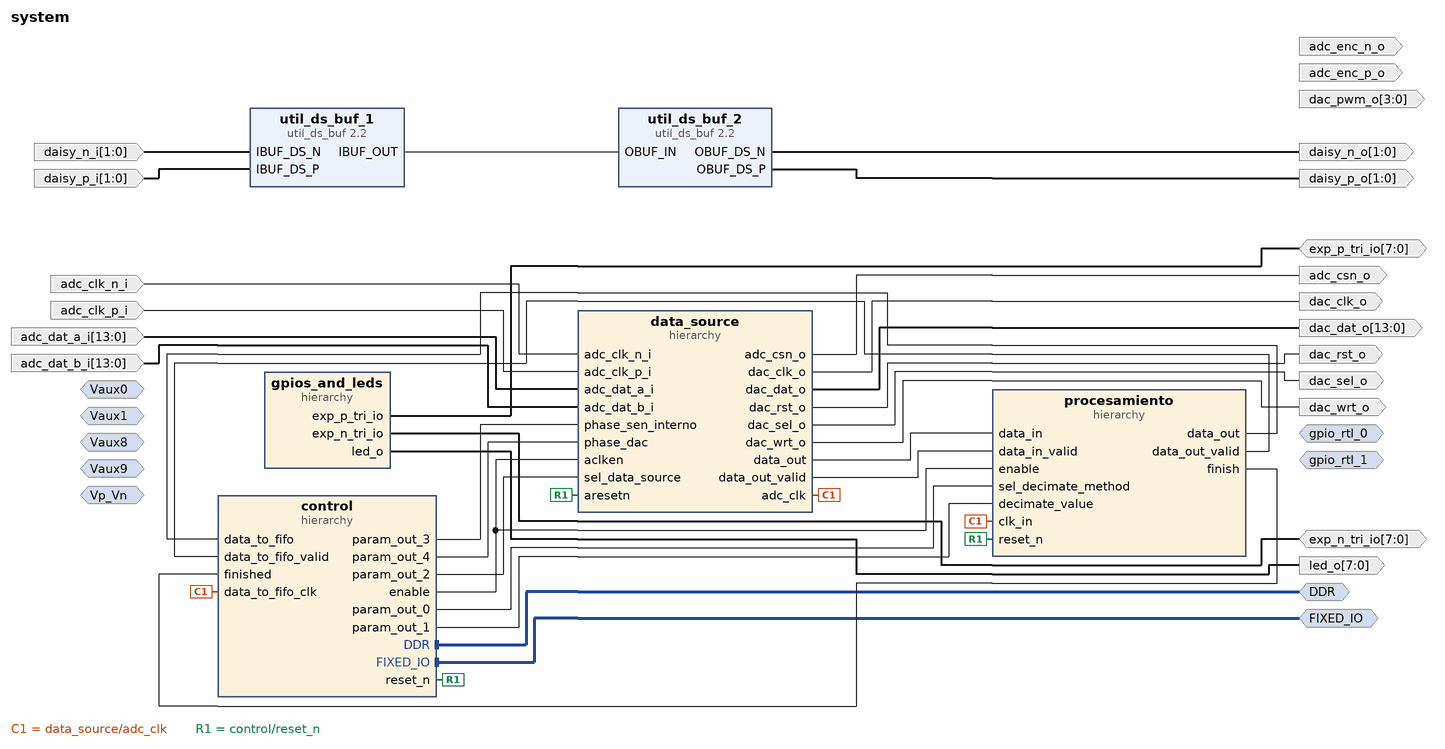
[diagram p0: block diagram of the top level]
# Vivado block design system, xc7z010clg400-1, Vivado 2022.2
create_bd_design system

create_bd_intf_port -mode Slave -vlnv xilinx.com:interface:diff_analog_io_rtl:1.0 Vp_Vn
create_bd_intf_port -mode Slave -vlnv xilinx.com:interface:diff_analog_io_rtl:1.0 Vaux0
create_bd_intf_port -mode Slave -vlnv xilinx.com:interface:diff_analog_io_rtl:1.0 Vaux1
create_bd_intf_port -mode Slave -vlnv xilinx.com:interface:diff_analog_io_rtl:1.0 Vaux9
create_bd_intf_port -mode Slave -vlnv xilinx.com:interface:diff_analog_io_rtl:1.0 Vaux8
create_bd_intf_port -mode Master -vlnv xilinx.com:interface:ddrx_rtl:1.0 DDR
create_bd_intf_port -mode Master -vlnv xilinx.com:display_processing_system7:fixedio_rtl:1.0 FIXED_IO
create_bd_intf_port -mode Master -vlnv xilinx.com:interface:gpio_rtl:1.0 gpio_rtl_0
create_bd_intf_port -mode Master -vlnv xilinx.com:interface:gpio_rtl:1.0 gpio_rtl_1
create_bd_port -dir I -from 13 -to 0 adc_dat_a_i
create_bd_port -dir I -from 13 -to 0 adc_dat_b_i
create_bd_port -dir I adc_clk_p_i
create_bd_port -dir I adc_clk_n_i
create_bd_port -dir O adc_enc_p_o
create_bd_port -dir O adc_enc_n_o
create_bd_port -dir O adc_csn_o
create_bd_port -dir O -from 13 -to 0 dac_dat_o
create_bd_port -dir O dac_clk_o
create_bd_port -dir O dac_rst_o
create_bd_port -dir O dac_sel_o
create_bd_port -dir O dac_wrt_o
create_bd_port -dir O -from 3 -to 0 dac_pwm_o
create_bd_port -dir IO -from 7 -to 0 exp_p_tri_io
create_bd_port -dir IO -from 7 -to 0 exp_n_tri_io
create_bd_port -dir O -from 1 -to 0 daisy_p_o
create_bd_port -dir O -from 1 -to 0 daisy_n_o
create_bd_port -dir I -from 1 -to 0 daisy_p_i
create_bd_port -dir I -from 1 -to 0 daisy_n_i
create_bd_port -dir O -from 7 -to 0 led_o

create_bd_cell -type ip -vlnv xilinx.com:ip:util_ds_buf:2.2 util_ds_buf_1
set_property -dict {CONFIG.C_SIZE 2} [get_bd_cells util_ds_buf_1]
create_bd_cell -type ip -vlnv xilinx.com:ip:util_ds_buf:2.2 util_ds_buf_2
set_property -dict {CONFIG.C_BUF_TYPE OBUFDS CONFIG.C_SIZE 2} [get_bd_cells util_ds_buf_2]
create_bd_cell -type hier gpios_and_leds
create_bd_cell -type hier control
create_bd_cell -type hier procesamiento
create_bd_cell -type hier data_source

# ---- hierarchy /gpios_and_leds ----
current_bd_instance /gpios_and_leds
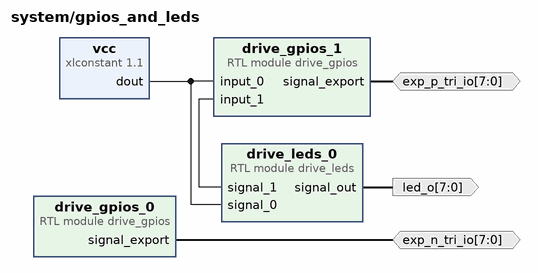
[diagram p1: block diagram inside /gpios_and_leds]
create_bd_pin -dir IO -from 7 -to 0 exp_n_tri_io
create_bd_pin -dir IO -from 7 -to 0 exp_p_tri_io
create_bd_pin -dir O -from 7 -to 0 led_o

create_bd_cell -type module -reference drive_gpios drive_gpios_0
create_bd_cell -type module -reference drive_gpios drive_gpios_1
create_bd_cell -type module -reference drive_leds drive_leds_0
create_bd_cell -type ip -vlnv xilinx.com:ip:xlconstant:1.1 vcc

# ---- hierarchy /control ----
current_bd_instance /control
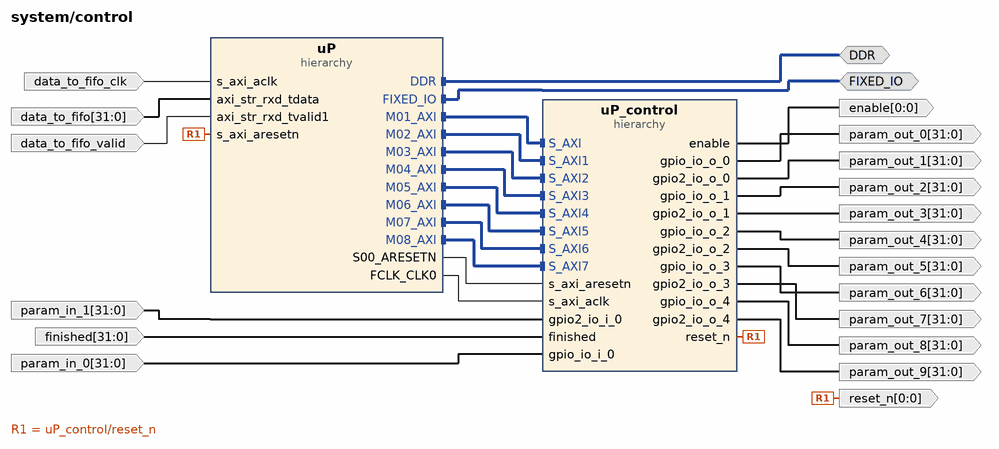
[diagram p2: block diagram inside /control]
create_bd_intf_pin -mode Master -vlnv xilinx.com:interface:ddrx_rtl:1.0 DDR
create_bd_intf_pin -mode Master -vlnv xilinx.com:display_processing_system7:fixedio_rtl:1.0 FIXED_IO
create_bd_pin -dir I data_to_fifo_valid
create_bd_pin -dir O -from 0 -to 0 reset_n
create_bd_pin -dir I -from 31 -to 0 data_to_fifo
create_bd_pin -dir I -type clk data_to_fifo_clk
create_bd_pin -dir O -from 0 -to 0 enable
create_bd_pin -dir O -from 31 -to 0 param_out_1
create_bd_pin -dir O -from 31 -to 0 param_out_0
create_bd_pin -dir O -from 31 -to 0 param_out_2
create_bd_pin -dir O -from 31 -to 0 param_out_3
create_bd_pin -dir O -from 31 -to 0 param_out_4
create_bd_pin -dir O -from 31 -to 0 param_out_5
create_bd_pin -dir O -from 31 -to 0 param_out_6
create_bd_pin -dir O -from 31 -to 0 param_out_7
create_bd_pin -dir O -from 31 -to 0 param_out_8
create_bd_pin -dir O -from 31 -to 0 param_out_9
create_bd_pin -dir I -from 31 -to 0 finished
create_bd_pin -dir I -from 31 -to 0 param_in_0
create_bd_pin -dir I -from 31 -to 0 param_in_1

create_bd_cell -type hier uP
create_bd_cell -type hier uP_control

# ---- hierarchy /control/uP ----
current_bd_instance /control/uP
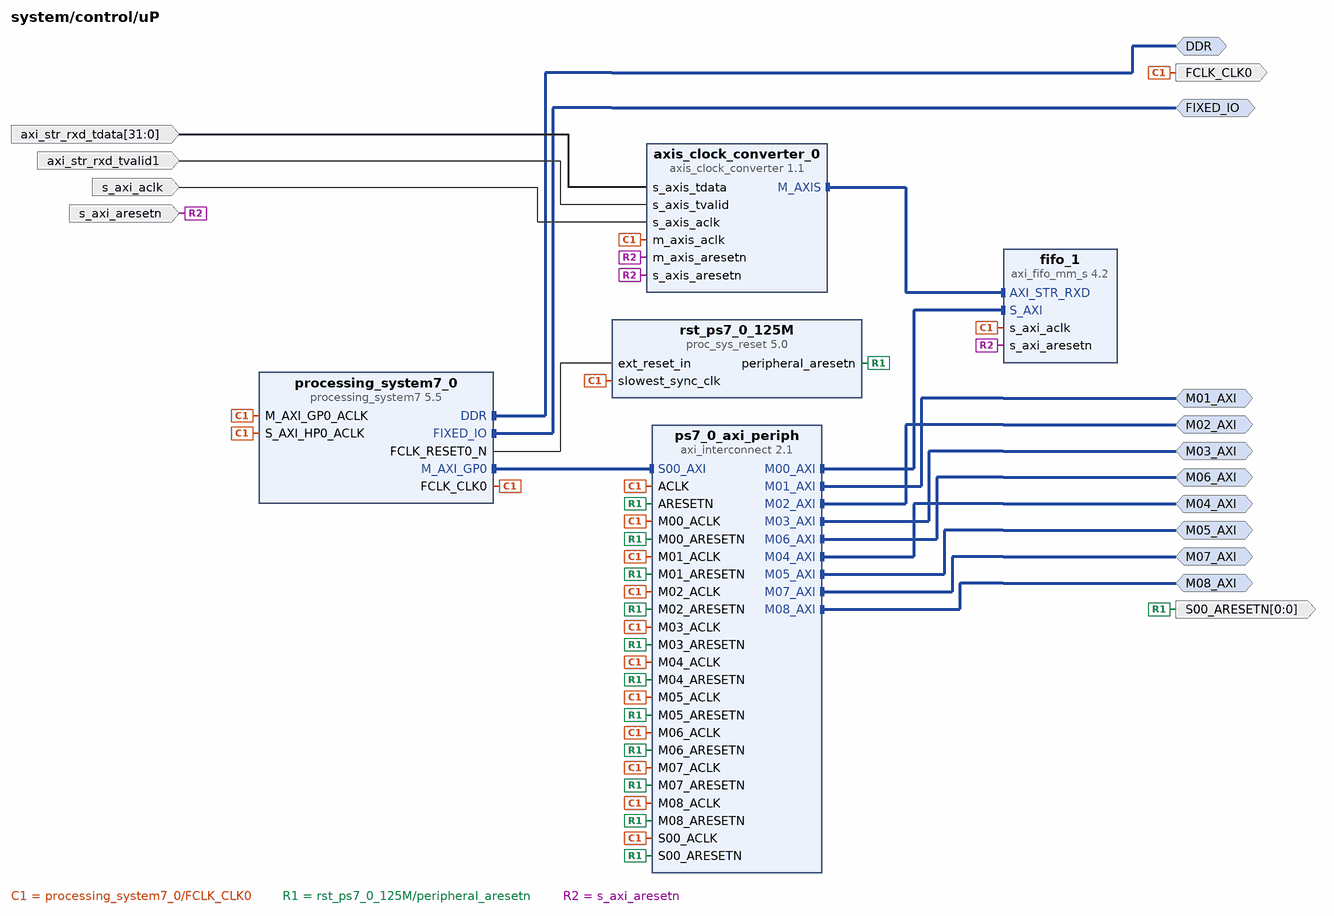
[diagram p3: block diagram inside /control/uP]
create_bd_intf_pin -mode Master -vlnv xilinx.com:interface:ddrx_rtl:1.0 DDR
create_bd_intf_pin -mode Master -vlnv xilinx.com:display_processing_system7:fixedio_rtl:1.0 FIXED_IO
create_bd_intf_pin -mode Master -vlnv xilinx.com:interface:aximm_rtl:1.0 M01_AXI
create_bd_intf_pin -mode Master -vlnv xilinx.com:interface:aximm_rtl:1.0 M03_AXI
create_bd_intf_pin -mode Master -vlnv xilinx.com:interface:aximm_rtl:1.0 M05_AXI
create_bd_intf_pin -mode Master -vlnv xilinx.com:interface:aximm_rtl:1.0 M06_AXI
create_bd_intf_pin -mode Master -vlnv xilinx.com:interface:aximm_rtl:1.0 M02_AXI
create_bd_intf_pin -mode Master -vlnv xilinx.com:interface:aximm_rtl:1.0 M07_AXI
create_bd_intf_pin -mode Master -vlnv xilinx.com:interface:aximm_rtl:1.0 M08_AXI
create_bd_intf_pin -mode Master -vlnv xilinx.com:interface:aximm_rtl:1.0 M04_AXI
create_bd_pin -dir O -type clk FCLK_CLK0
create_bd_pin -dir O -from 0 -to 0 -type rst S00_ARESETN
create_bd_pin -dir I axi_str_rxd_tvalid1
create_bd_pin -dir I -type rst s_axi_aresetn
create_bd_pin -dir I -from 31 -to 0 axi_str_rxd_tdata
create_bd_pin -dir I -type clk s_axi_aclk

create_bd_cell -type ip -vlnv xilinx.com:ip:processing_system7:5.5 processing_system7_0
set_property -dict [list \
  CONFIG.PCW_APU_PERIPHERAL_FREQMHZ 666.666666 \
  CONFIG.PCW_ENET0_ENET0_IO {MIO 16 .. 27} \
  CONFIG.PCW_ENET0_GRP_MDIO_ENABLE 1 \
  CONFIG.PCW_ENET0_GRP_MDIO_IO EMIO \
  CONFIG.PCW_ENET0_PERIPHERAL_ENABLE 1 \
  CONFIG.PCW_ENET0_RESET_ENABLE 0 \
  CONFIG.PCW_ENET_RESET_ENABLE 1 \
  CONFIG.PCW_ENET_RESET_SELECT {Share reset pin} \
  CONFIG.PCW_FPGA0_PERIPHERAL_FREQMHZ 125 \
  CONFIG.PCW_FPGA1_PERIPHERAL_FREQMHZ 250 \
  CONFIG.PCW_FPGA3_PERIPHERAL_FREQMHZ 200 \
  CONFIG.PCW_GPIO_MIO_GPIO_ENABLE 1 \
  CONFIG.PCW_GPIO_MIO_GPIO_IO MIO \
  CONFIG.PCW_GPIO_PERIPHERAL_ENABLE 1 \
  CONFIG.PCW_I2C0_GRP_INT_ENABLE 0 \
  CONFIG.PCW_I2C0_I2C0_IO {MIO 50 .. 51} \
  CONFIG.PCW_I2C0_PERIPHERAL_ENABLE 1 \
  CONFIG.PCW_I2C_PERIPHERAL_FREQMHZ 111.111115 \
  CONFIG.PCW_I2C_RESET_ENABLE 1 \
  CONFIG.PCW_I2C_RESET_SELECT {Share reset pin} \
  CONFIG.PCW_IMPORT_BOARD_PRESET cfg/red_pitaya.xml \
  CONFIG.PCW_PRESET_BANK1_VOLTAGE {LVCMOS 2.5V} \
  CONFIG.PCW_QSPI_GRP_SINGLE_SS_ENABLE 1 \
  CONFIG.PCW_QSPI_GRP_SINGLE_SS_IO {MIO 1 .. 6} \
  CONFIG.PCW_QSPI_PERIPHERAL_ENABLE 1 \
  CONFIG.PCW_QSPI_PERIPHERAL_FREQMHZ 125 \
  CONFIG.PCW_QSPI_QSPI_IO {MIO 1 .. 6} \
  CONFIG.PCW_SD0_GRP_CD_ENABLE 1 \
  CONFIG.PCW_SD0_GRP_CD_IO {MIO 46} \
  CONFIG.PCW_SD0_GRP_WP_ENABLE 1 \
  CONFIG.PCW_SD0_GRP_WP_IO {MIO 47} \
  CONFIG.PCW_SD0_PERIPHERAL_ENABLE 1 \
  CONFIG.PCW_SD0_SD0_IO {MIO 40 .. 45} \
  CONFIG.PCW_SDIO_PERIPHERAL_FREQMHZ 100 \
  CONFIG.PCW_SINGLE_QSPI_DATA_MODE x4 \
  CONFIG.PCW_SPI0_PERIPHERAL_ENABLE 1 \
  CONFIG.PCW_SPI0_SPI0_IO EMIO \
  CONFIG.PCW_SPI1_PERIPHERAL_ENABLE 1 \
  CONFIG.PCW_SPI1_SPI1_IO {MIO 10 .. 15} \
  CONFIG.PCW_TTC0_PERIPHERAL_ENABLE 1 \
  CONFIG.PCW_TTC0_TTC0_IO EMIO \
  CONFIG.PCW_UART0_PERIPHERAL_ENABLE 1 \
  CONFIG.PCW_UART0_UART0_IO {MIO 14 .. 15} \
  CONFIG.PCW_UART1_PERIPHERAL_ENABLE 1 \
  CONFIG.PCW_UART1_UART1_IO {MIO 8 .. 9} \
  CONFIG.PCW_UART_PERIPHERAL_FREQMHZ 100 \
  CONFIG.PCW_UIPARAM_DDR_BUS_WIDTH {16 Bit} \
  CONFIG.PCW_UIPARAM_DDR_FREQ_MHZ 533.333333 \
  CONFIG.PCW_UIPARAM_DDR_PARTNO {MT41J256M16 RE-125} \
  CONFIG.PCW_USB0_PERIPHERAL_ENABLE 1 \
  CONFIG.PCW_USB0_RESET_ENABLE 1 \
  CONFIG.PCW_USB0_RESET_IO {MIO 48} \
  CONFIG.PCW_USB0_USB0_IO {MIO 28 .. 39} \
  CONFIG.PCW_USB_RESET_ENABLE 1 \
  CONFIG.PCW_USB_RESET_SELECT {Share reset pin} \
  CONFIG.PCW_USE_S_AXI_HP0 1 \
] [get_bd_cells processing_system7_0]
# 429 more settings of processing_system7_0 are not shown: defaults, MIO pin electricals, DDR timing, and values the tool derives
create_bd_cell -type ip -vlnv xilinx.com:ip:proc_sys_reset:5.0 rst_ps7_0_125M
create_bd_cell -type ip -vlnv xilinx.com:ip:axi_interconnect:2.1 ps7_0_axi_periph
set_property -dict {CONFIG.NUM_MI 9} [get_bd_cells ps7_0_axi_periph]
create_bd_cell -type ip -vlnv xilinx.com:ip:axi_fifo_mm_s:4.2 fifo_1
set_property -dict {CONFIG.C_DATA_INTERFACE_TYPE 0 CONFIG.C_USE_TX_CTRL 0 CONFIG.C_USE_TX_DATA 0} [get_bd_cells fifo_1]
create_bd_cell -type ip -vlnv xilinx.com:ip:axis_clock_converter:1.1 axis_clock_converter_0
set_property -dict [list \
  CONFIG.ACLKEN_CONV_MODE 0 \
  CONFIG.IS_ACLK_ASYNC 1 \
  CONFIG.SYNCHRONIZATION_STAGES 2 \
  CONFIG.TDATA_NUM_BYTES 4 \
] [get_bd_cells axis_clock_converter_0]

# ---- hierarchy /control/uP_control ----
current_bd_instance /control/uP_control
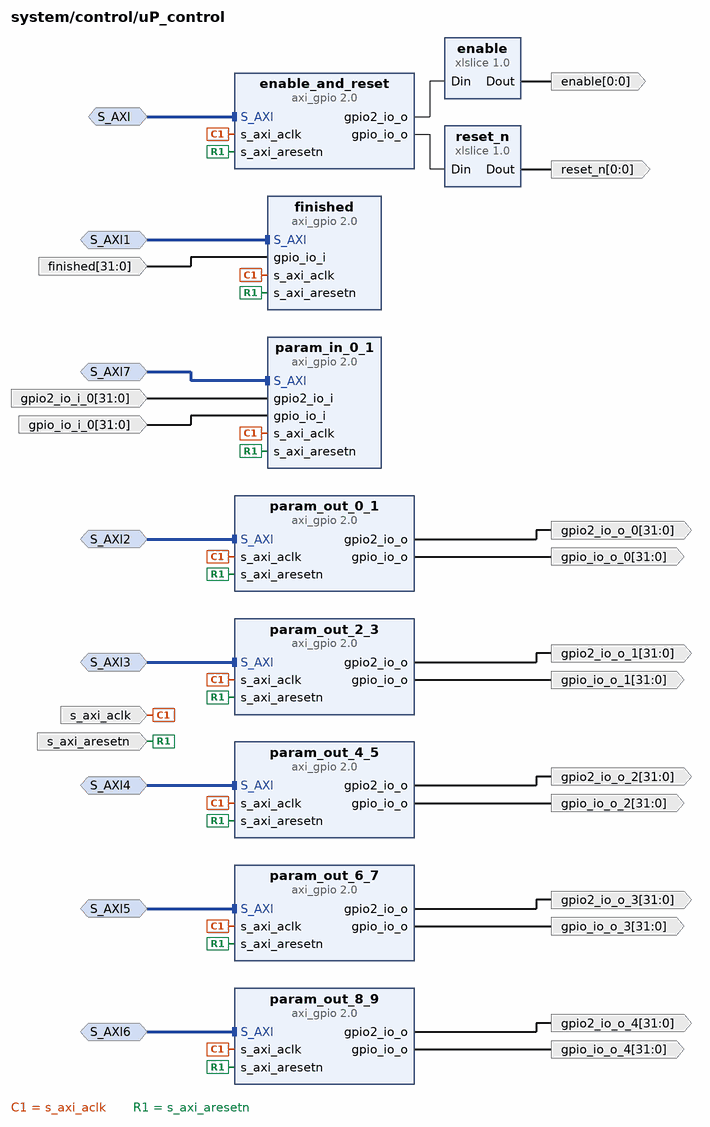
[diagram p4: block diagram inside /control/uP_control]
create_bd_intf_pin -mode Slave -vlnv xilinx.com:interface:aximm_rtl:1.0 S_AXI
create_bd_intf_pin -mode Slave -vlnv xilinx.com:interface:aximm_rtl:1.0 S_AXI1
create_bd_intf_pin -mode Slave -vlnv xilinx.com:interface:aximm_rtl:1.0 S_AXI2
create_bd_intf_pin -mode Slave -vlnv xilinx.com:interface:aximm_rtl:1.0 S_AXI3
create_bd_intf_pin -mode Slave -vlnv xilinx.com:interface:aximm_rtl:1.0 S_AXI4
create_bd_intf_pin -mode Slave -vlnv xilinx.com:interface:aximm_rtl:1.0 S_AXI5
create_bd_intf_pin -mode Slave -vlnv xilinx.com:interface:aximm_rtl:1.0 S_AXI6
create_bd_intf_pin -mode Slave -vlnv xilinx.com:interface:aximm_rtl:1.0 S_AXI7
create_bd_pin -dir I -type clk s_axi_aclk
create_bd_pin -dir I -type rst s_axi_aresetn
create_bd_pin -dir O -from 0 -to 0 reset_n
create_bd_pin -dir O -from 0 -to 0 enable
create_bd_pin -dir O -from 31 -to 0 gpio2_io_o_0
create_bd_pin -dir O -from 31 -to 0 gpio_io_o_0
create_bd_pin -dir O -from 31 -to 0 gpio_io_o_1
create_bd_pin -dir O -from 31 -to 0 gpio2_io_o_1
create_bd_pin -dir O -from 31 -to 0 gpio_io_o_2
create_bd_pin -dir O -from 31 -to 0 gpio2_io_o_2
create_bd_pin -dir O -from 31 -to 0 gpio_io_o_3
create_bd_pin -dir O -from 31 -to 0 gpio2_io_o_3
create_bd_pin -dir O -from 31 -to 0 gpio_io_o_4
create_bd_pin -dir O -from 31 -to 0 gpio2_io_o_4
create_bd_pin -dir I -from 31 -to 0 finished
create_bd_pin -dir I -from 31 -to 0 gpio_io_i_0
create_bd_pin -dir I -from 31 -to 0 gpio2_io_i_0

create_bd_cell -type ip -vlnv xilinx.com:ip:xlslice:1.0 reset_n
set_property -dict {CONFIG.DIN_FROM 0 CONFIG.DIN_TO 0 CONFIG.DOUT_WIDTH 1} [get_bd_cells reset_n]
create_bd_cell -type ip -vlnv xilinx.com:ip:axi_gpio:2.0 finished
set_property -dict {CONFIG.C_ALL_INPUTS 1 CONFIG.C_IS_DUAL 0} [get_bd_cells finished]
create_bd_cell -type ip -vlnv xilinx.com:ip:xlslice:1.0 enable
set_property -dict {CONFIG.DIN_FROM 0} [get_bd_cells enable]
create_bd_cell -type ip -vlnv xilinx.com:ip:axi_gpio:2.0 enable_and_reset
set_property -dict {CONFIG.C_ALL_INPUTS 0 CONFIG.C_ALL_OUTPUTS 0 CONFIG.C_IS_DUAL 1} [get_bd_cells enable_and_reset]
create_bd_cell -type ip -vlnv xilinx.com:ip:axi_gpio:2.0 param_out_4_5
set_property -dict [list \
  CONFIG.C_ALL_INPUTS 0 \
  CONFIG.C_ALL_OUTPUTS 1 \
  CONFIG.C_ALL_OUTPUTS_2 1 \
  CONFIG.C_IS_DUAL 1 \
] [get_bd_cells param_out_4_5]
create_bd_cell -type ip -vlnv xilinx.com:ip:axi_gpio:2.0 param_out_2_3
set_property -dict [list \
  CONFIG.C_ALL_INPUTS 0 \
  CONFIG.C_ALL_OUTPUTS 1 \
  CONFIG.C_ALL_OUTPUTS_2 1 \
  CONFIG.C_IS_DUAL 1 \
] [get_bd_cells param_out_2_3]
create_bd_cell -type ip -vlnv xilinx.com:ip:axi_gpio:2.0 param_out_6_7
set_property -dict [list \
  CONFIG.C_ALL_INPUTS 0 \
  CONFIG.C_ALL_OUTPUTS 1 \
  CONFIG.C_ALL_OUTPUTS_2 1 \
  CONFIG.C_IS_DUAL 1 \
] [get_bd_cells param_out_6_7]
create_bd_cell -type ip -vlnv xilinx.com:ip:axi_gpio:2.0 param_out_0_1
set_property -dict [list \
  CONFIG.C_ALL_INPUTS 0 \
  CONFIG.C_ALL_OUTPUTS 1 \
  CONFIG.C_ALL_OUTPUTS_2 1 \
  CONFIG.C_IS_DUAL 1 \
] [get_bd_cells param_out_0_1]
create_bd_cell -type ip -vlnv xilinx.com:ip:axi_gpio:2.0 param_out_8_9
set_property -dict [list \
  CONFIG.C_ALL_INPUTS 0 \
  CONFIG.C_ALL_OUTPUTS 1 \
  CONFIG.C_ALL_OUTPUTS_2 1 \
  CONFIG.C_IS_DUAL 1 \
] [get_bd_cells param_out_8_9]
create_bd_cell -type ip -vlnv xilinx.com:ip:axi_gpio:2.0 param_in_0_1
set_property -dict {CONFIG.C_ALL_INPUTS 1 CONFIG.C_ALL_INPUTS_2 1 CONFIG.C_IS_DUAL 1} [get_bd_cells param_in_0_1]

# ---- hierarchy /procesamiento ----
current_bd_instance /procesamiento
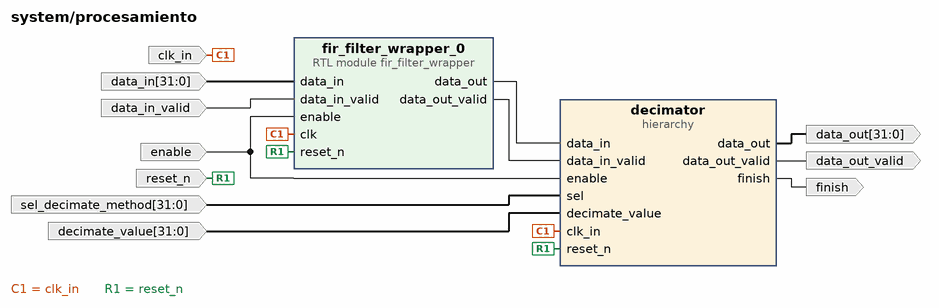
[diagram p5: block diagram inside /procesamiento]
create_bd_pin -dir I clk_in
create_bd_pin -dir I reset_n
create_bd_pin -dir I enable
create_bd_pin -dir I data_in_valid
create_bd_pin -dir I -from 31 -to 0 decimate_value
create_bd_pin -dir O -from 31 -to 0 data_out
create_bd_pin -dir O data_out_valid
create_bd_pin -dir I -from 31 -to 0 sel_decimate_method
create_bd_pin -dir I -from 31 -to 0 data_in
create_bd_pin -dir O finish

create_bd_cell -type hier decimator
create_bd_cell -type module -reference fir_filter_wrapper fir_filter_wrapper_0

# ---- hierarchy /procesamiento/decimator ----
current_bd_instance /procesamiento/decimator
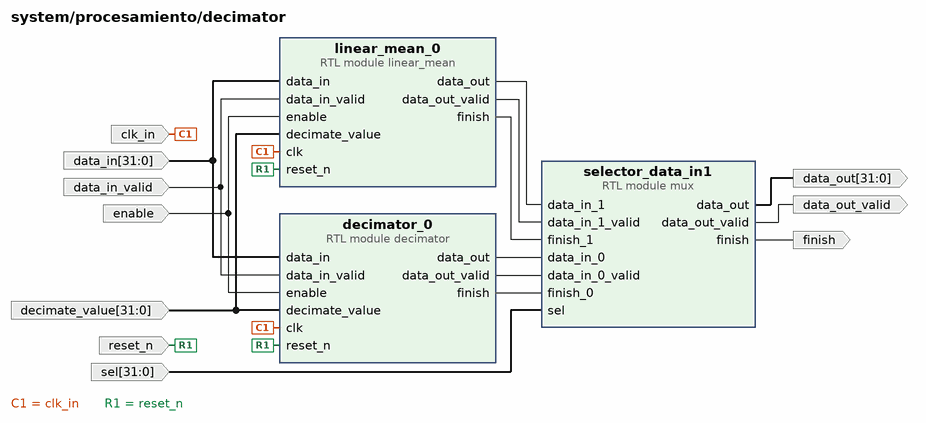
[diagram p6: block diagram inside /procesamiento/decimator]
create_bd_pin -dir I clk_in
create_bd_pin -dir I -type rst reset_n
create_bd_pin -dir I enable
create_bd_pin -dir I data_in_valid
create_bd_pin -dir I -from 31 -to 0 decimate_value
create_bd_pin -dir O finish
create_bd_pin -dir O -from 31 -to 0 data_out
create_bd_pin -dir O data_out_valid
create_bd_pin -dir I -from 31 -to 0 sel
create_bd_pin -dir I -from 31 -to 0 data_in

create_bd_cell -type module -reference decimator decimator_0
create_bd_cell -type module -reference mux selector_data_in1
set_property -dict {CONFIG.DATA_IN_WIDTH 32 CONFIG.DATA_OUT_WIDTH 32} [get_bd_cells selector_data_in1]
create_bd_cell -type module -reference linear_mean linear_mean_0

# ---- hierarchy /data_source ----
current_bd_instance /data_source
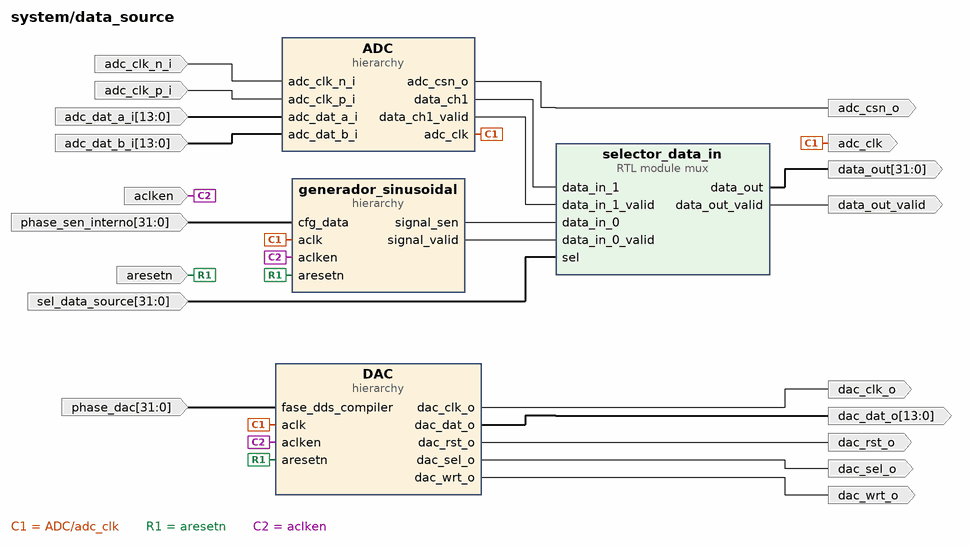
[diagram p7: block diagram inside /data_source]
create_bd_pin -dir I -from 31 -to 0 sel_data_source
create_bd_pin -dir O -from 31 -to 0 data_out
create_bd_pin -dir O data_out_valid
create_bd_pin -dir O -type clk adc_clk
create_bd_pin -dir I -type rst aresetn
create_bd_pin -dir I -type ce aclken
create_bd_pin -dir O -type clk dac_clk_o
create_bd_pin -dir O -type rst dac_rst_o
create_bd_pin -dir O dac_sel_o
create_bd_pin -dir O dac_wrt_o
create_bd_pin -dir O -from 13 -to 0 dac_dat_o
create_bd_pin -dir O adc_csn_o
create_bd_pin -dir I adc_clk_p_i
create_bd_pin -dir I adc_clk_n_i
create_bd_pin -dir I -from 13 -to 0 adc_dat_a_i
create_bd_pin -dir I -from 13 -to 0 adc_dat_b_i
create_bd_pin -dir I -from 31 -to 0 phase_sen_interno
create_bd_pin -dir I -from 31 -to 0 phase_dac

create_bd_cell -type module -reference mux selector_data_in
set_property -dict {CONFIG.DATA_OUT_WIDTH 32} [get_bd_cells selector_data_in]
create_bd_cell -type hier generador_sinusoidal
create_bd_cell -type hier DAC
create_bd_cell -type hier ADC

# ---- hierarchy /data_source/generador_sinusoidal ----
current_bd_instance /data_source/generador_sinusoidal
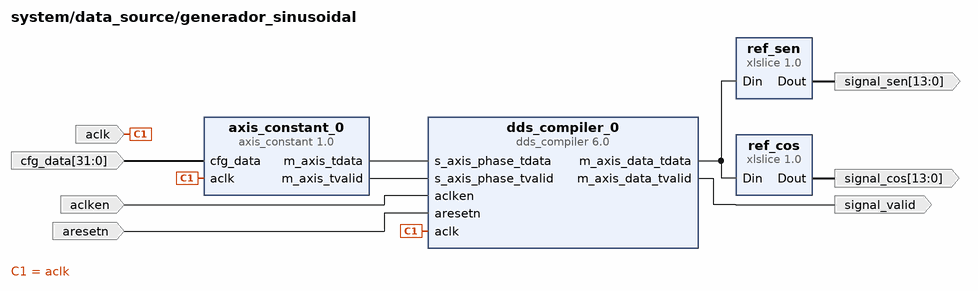
[diagram p8: block diagram inside /data_source/generador_sinusoidal]
create_bd_pin -dir I -type clk aclk
create_bd_pin -dir I -from 31 -to 0 cfg_data
create_bd_pin -dir O signal_valid
create_bd_pin -dir I -type rst aresetn
create_bd_pin -dir I -type ce aclken
create_bd_pin -dir O -from 13 -to 0 signal_sen
create_bd_pin -dir O -from 13 -to 0 signal_cos

create_bd_cell -type ip -vlnv pavel-demin:user:axis_constant:1.0 axis_constant_0
create_bd_cell -type ip -vlnv xilinx.com:ip:xlslice:1.0 ref_sen
set_property -dict {CONFIG.DIN_FROM 29 CONFIG.DIN_TO 16} [get_bd_cells ref_sen]
create_bd_cell -type ip -vlnv xilinx.com:ip:dds_compiler:6.0 dds_compiler_0
set_property -dict [list \
  CONFIG.Amplitude_Mode Unit_Circle \
  CONFIG.DATA_Has_TLAST Not_Required \
  CONFIG.DDS_Clock_Rate 125 \
  CONFIG.Frequency_Resolution 0.5 \
  CONFIG.Has_ACLKEN true \
  CONFIG.Has_ARESETn true \
  CONFIG.Has_Phase_Out false \
  CONFIG.Latency 8 \
  CONFIG.M_DATA_Has_TUSER Not_Required \
  CONFIG.Negative_Cosine false \
  CONFIG.Noise_Shaping Auto \
  CONFIG.Output_Frequency1 0 \
  CONFIG.Output_Width 14 \
  CONFIG.PINC1 0 \
  CONFIG.Phase_Increment Streaming \
  CONFIG.Phase_Width 28 \
  CONFIG.S_PHASE_Has_TUSER Not_Required \
  CONFIG.Spurious_Free_Dynamic_Range 84 \
] [get_bd_cells dds_compiler_0]
create_bd_cell -type ip -vlnv xilinx.com:ip:xlslice:1.0 ref_cos
set_property -dict {CONFIG.DIN_FROM 13} [get_bd_cells ref_cos]

# ---- hierarchy /data_source/DAC ----
current_bd_instance /data_source/DAC
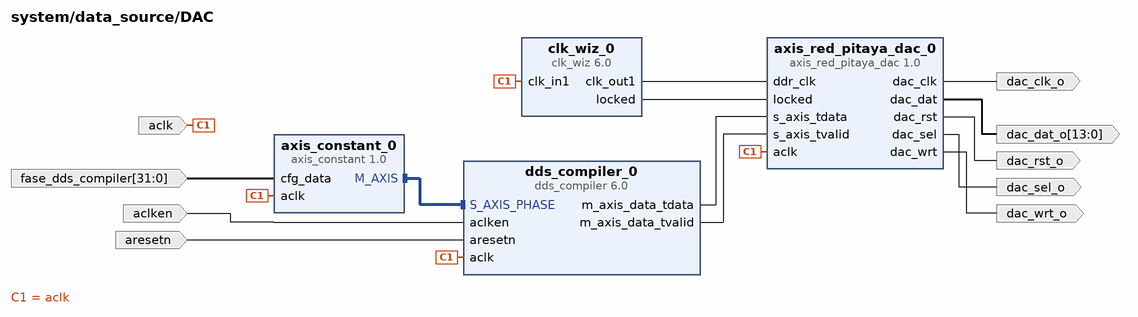
[diagram p9: block diagram inside /data_source/DAC]
create_bd_pin -dir I -type clk aclk
create_bd_pin -dir O -type clk dac_clk_o
create_bd_pin -dir O -type rst dac_rst_o
create_bd_pin -dir O dac_sel_o
create_bd_pin -dir O dac_wrt_o
create_bd_pin -dir O -from 13 -to 0 dac_dat_o
create_bd_pin -dir I -from 31 -to 0 fase_dds_compiler
create_bd_pin -dir I -type ce aclken
create_bd_pin -dir I -type rst aresetn

create_bd_cell -type ip -vlnv pavel-demin:user:axis_red_pitaya_dac:1.0 axis_red_pitaya_dac_0
create_bd_cell -type ip -vlnv xilinx.com:ip:dds_compiler:6.0 dds_compiler_0
set_property -dict [list \
  CONFIG.Amplitude_Mode Unit_Circle \
  CONFIG.DATA_Has_TLAST Not_Required \
  CONFIG.DDS_Clock_Rate 125 \
  CONFIG.Frequency_Resolution 0.5 \
  CONFIG.Has_ACLKEN true \
  CONFIG.Has_ARESETn true \
  CONFIG.Has_Phase_Out false \
  CONFIG.Latency 8 \
  CONFIG.M_DATA_Has_TUSER Not_Required \
  CONFIG.Negative_Cosine false \
  CONFIG.Noise_Shaping Auto \
  CONFIG.Output_Frequency1 0 \
  CONFIG.Output_Width 14 \
  CONFIG.PINC1 0 \
  CONFIG.Phase_Increment Streaming \
  CONFIG.Phase_Width 28 \
  CONFIG.S_PHASE_Has_TUSER Not_Required \
  CONFIG.Spurious_Free_Dynamic_Range 84 \
] [get_bd_cells dds_compiler_0]
create_bd_cell -type ip -vlnv xilinx.com:ip:clk_wiz:6.0 clk_wiz_0
set_property -dict [list \
  CONFIG.CLKIN1_JITTER_PS 80.0 \
  CONFIG.CLKOUT1_JITTER 104.759 \
  CONFIG.CLKOUT1_PHASE_ERROR 96.948 \
  CONFIG.CLKOUT1_REQUESTED_OUT_FREQ 250.000 \
  CONFIG.MMCM_CLKFBOUT_MULT_F 8.000 \
  CONFIG.MMCM_CLKIN1_PERIOD 8.000 \
  CONFIG.MMCM_CLKOUT0_DIVIDE_F 4.000 \
  CONFIG.PRIM_IN_FREQ 125.000 \
  CONFIG.USE_RESET false \
] [get_bd_cells clk_wiz_0]
create_bd_cell -type ip -vlnv pavel-demin:user:axis_constant:1.0 axis_constant_0

# ---- hierarchy /data_source/ADC ----
current_bd_instance /data_source/ADC
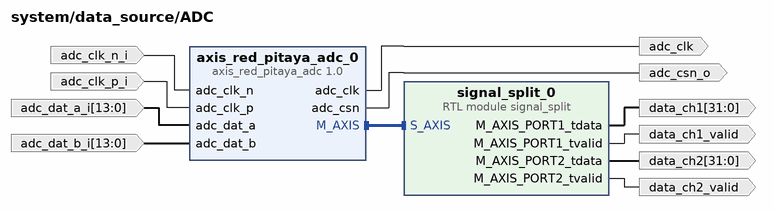
[diagram p10: block diagram inside /data_source/ADC]
create_bd_pin -dir O -from 31 -to 0 data_ch1
create_bd_pin -dir O data_ch1_valid
create_bd_pin -dir O -type clk adc_clk
create_bd_pin -dir O adc_csn_o
create_bd_pin -dir I adc_clk_p_i
create_bd_pin -dir I adc_clk_n_i
create_bd_pin -dir I -from 13 -to 0 adc_dat_a_i
create_bd_pin -dir I -from 13 -to 0 adc_dat_b_i
create_bd_pin -dir O -from 31 -to 0 data_ch2
create_bd_pin -dir O data_ch2_valid

create_bd_cell -type ip -vlnv pavel-demin:user:axis_red_pitaya_adc:1.0 axis_red_pitaya_adc_0
create_bd_cell -type module -reference signal_split signal_split_0

# ---- connections ----

current_bd_instance /gpios_and_leds
connect_bd_net [get_bd_pins exp_p_tri_io] [get_bd_pins drive_gpios_1/signal_export]
connect_bd_net [get_bd_pins exp_n_tri_io] [get_bd_pins drive_gpios_0/signal_export]
connect_bd_net [get_bd_pins drive_leds_0/signal_out] [get_bd_pins led_o]
connect_bd_net -net input_0_1 [get_bd_pins vcc/dout] [get_bd_pins drive_gpios_1/input_0] [get_bd_pins drive_leds_0/signal_0]
connect_bd_net -net level_detector_0_level_detected_1 [get_bd_pins drive_gpios_1/input_1] [get_bd_pins drive_leds_0/signal_1]

current_bd_instance /control
connect_bd_intf_net -intf_net processing_system7_0_DDR [get_bd_intf_pins DDR] [get_bd_intf_pins uP/DDR]
connect_bd_intf_net -intf_net processing_system7_0_FIXED_IO [get_bd_intf_pins FIXED_IO] [get_bd_intf_pins uP/FIXED_IO]
connect_bd_intf_net [get_bd_intf_pins uP/M01_AXI] [get_bd_intf_pins uP_control/S_AXI]
connect_bd_intf_net [get_bd_intf_pins uP/M02_AXI] [get_bd_intf_pins uP_control/S_AXI1]
connect_bd_intf_net [get_bd_intf_pins uP/M03_AXI] [get_bd_intf_pins uP_control/S_AXI2]
connect_bd_intf_net [get_bd_intf_pins uP/M04_AXI] [get_bd_intf_pins uP_control/S_AXI3]
connect_bd_intf_net [get_bd_intf_pins uP/M05_AXI] [get_bd_intf_pins uP_control/S_AXI4]
connect_bd_intf_net [get_bd_intf_pins uP/M06_AXI] [get_bd_intf_pins uP_control/S_AXI5]
connect_bd_intf_net [get_bd_intf_pins uP/M07_AXI] [get_bd_intf_pins uP_control/S_AXI6]
connect_bd_intf_net [get_bd_intf_pins uP/M08_AXI] [get_bd_intf_pins uP_control/S_AXI7]
connect_bd_net -net ADC_adc_clk [get_bd_pins data_to_fifo_clk] [get_bd_pins uP/s_axi_aclk]
connect_bd_net -net axi_str_rxd_tdata_1 [get_bd_pins data_to_fifo] [get_bd_pins uP/axi_str_rxd_tdata]
connect_bd_net -net axi_str_rxd_tvalid1_1 [get_bd_pins data_to_fifo_valid] [get_bd_pins uP/axi_str_rxd_tvalid1]
connect_bd_net -net gpio2_io_i_0_1 [get_bd_pins param_in_1] [get_bd_pins uP_control/gpio2_io_i_0]
connect_bd_net -net gpio_io_i_0_1 [get_bd_pins finished] [get_bd_pins uP_control/finished]
connect_bd_net -net gpio_io_i_0_2 [get_bd_pins param_in_0] [get_bd_pins uP_control/gpio_io_i_0]
connect_bd_net -net rst_ps7_0_125M_peripheral_aresetn [get_bd_pins uP/S00_ARESETN] [get_bd_pins uP_control/s_axi_aresetn]
connect_bd_net -net s_axi_aclk_1 [get_bd_pins uP/FCLK_CLK0] [get_bd_pins uP_control/s_axi_aclk]
connect_bd_net -net uP_control_Dout [get_bd_pins uP_control/reset_n] [get_bd_pins reset_n] [get_bd_pins uP/s_axi_aresetn]
connect_bd_net -net uP_control_Dout1 [get_bd_pins uP_control/enable] [get_bd_pins enable]
connect_bd_net [get_bd_pins uP_control/gpio2_io_o_0] [get_bd_pins param_out_1]
connect_bd_net [get_bd_pins uP_control/gpio2_io_o_1] [get_bd_pins param_out_3]
connect_bd_net [get_bd_pins uP_control/gpio2_io_o_2] [get_bd_pins param_out_5]
connect_bd_net [get_bd_pins uP_control/gpio2_io_o_3] [get_bd_pins param_out_7]
connect_bd_net [get_bd_pins uP_control/gpio2_io_o_4] [get_bd_pins param_out_9]
connect_bd_net [get_bd_pins uP_control/gpio_io_o_0] [get_bd_pins param_out_0]
connect_bd_net [get_bd_pins uP_control/gpio_io_o_1] [get_bd_pins param_out_2]
connect_bd_net [get_bd_pins uP_control/gpio_io_o_2] [get_bd_pins param_out_4]
connect_bd_net [get_bd_pins uP_control/gpio_io_o_3] [get_bd_pins param_out_6]
connect_bd_net [get_bd_pins uP_control/gpio_io_o_4] [get_bd_pins param_out_8]

current_bd_instance /control/uP
connect_bd_intf_net [get_bd_intf_pins M06_AXI] [get_bd_intf_pins ps7_0_axi_periph/M06_AXI]
connect_bd_intf_net [get_bd_intf_pins axis_clock_converter_0/M_AXIS] [get_bd_intf_pins fifo_1/AXI_STR_RXD]
connect_bd_intf_net [get_bd_intf_pins DDR] [get_bd_intf_pins processing_system7_0/DDR]
connect_bd_intf_net [get_bd_intf_pins FIXED_IO] [get_bd_intf_pins processing_system7_0/FIXED_IO]
connect_bd_intf_net [get_bd_intf_pins processing_system7_0/M_AXI_GP0] [get_bd_intf_pins ps7_0_axi_periph/S00_AXI]
connect_bd_intf_net [get_bd_intf_pins fifo_1/S_AXI] [get_bd_intf_pins ps7_0_axi_periph/M00_AXI]
connect_bd_intf_net [get_bd_intf_pins M01_AXI] [get_bd_intf_pins ps7_0_axi_periph/M01_AXI]
connect_bd_intf_net [get_bd_intf_pins M02_AXI] [get_bd_intf_pins ps7_0_axi_periph/M02_AXI]
connect_bd_intf_net [get_bd_intf_pins M03_AXI] [get_bd_intf_pins ps7_0_axi_periph/M03_AXI]
connect_bd_intf_net [get_bd_intf_pins M04_AXI] [get_bd_intf_pins ps7_0_axi_periph/M04_AXI]
connect_bd_intf_net [get_bd_intf_pins M05_AXI] [get_bd_intf_pins ps7_0_axi_periph/M05_AXI]
connect_bd_intf_net [get_bd_intf_pins M07_AXI] [get_bd_intf_pins ps7_0_axi_periph/M07_AXI]
connect_bd_intf_net [get_bd_intf_pins M08_AXI] [get_bd_intf_pins ps7_0_axi_periph/M08_AXI]
connect_bd_net [get_bd_pins axi_str_rxd_tdata] [get_bd_pins axis_clock_converter_0/s_axis_tdata]
connect_bd_net -net axi_str_rxd_tvalid1_1 [get_bd_pins axi_str_rxd_tvalid1] [get_bd_pins axis_clock_converter_0/s_axis_tvalid]
connect_bd_net [get_bd_pins processing_system7_0/FCLK_CLK0] \
  [get_bd_pins FCLK_CLK0] [get_bd_pins ps7_0_axi_periph/M01_ACLK] [get_bd_pins ps7_0_axi_periph/S00_ACLK] \
  [get_bd_pins ps7_0_axi_periph/ACLK] [get_bd_pins rst_ps7_0_125M/slowest_sync_clk] \
  [get_bd_pins processing_system7_0/S_AXI_HP0_ACLK] [get_bd_pins ps7_0_axi_periph/M00_ACLK] \
  [get_bd_pins ps7_0_axi_periph/M02_ACLK] [get_bd_pins ps7_0_axi_periph/M03_ACLK] \
  [get_bd_pins processing_system7_0/M_AXI_GP0_ACLK] [get_bd_pins ps7_0_axi_periph/M04_ACLK] \
  [get_bd_pins ps7_0_axi_periph/M05_ACLK] [get_bd_pins ps7_0_axi_periph/M06_ACLK] [get_bd_pins ps7_0_axi_periph/M07_ACLK] \
  [get_bd_pins ps7_0_axi_periph/M08_ACLK] [get_bd_pins fifo_1/s_axi_aclk] [get_bd_pins axis_clock_converter_0/m_axis_aclk]
connect_bd_net [get_bd_pins processing_system7_0/FCLK_RESET0_N] [get_bd_pins rst_ps7_0_125M/ext_reset_in]
connect_bd_net [get_bd_pins rst_ps7_0_125M/peripheral_aresetn] \
  [get_bd_pins S00_ARESETN] [get_bd_pins ps7_0_axi_periph/S00_ARESETN] [get_bd_pins ps7_0_axi_periph/M00_ARESETN] \
  [get_bd_pins ps7_0_axi_periph/ARESETN] [get_bd_pins ps7_0_axi_periph/M01_ARESETN] \
  [get_bd_pins ps7_0_axi_periph/M02_ARESETN] [get_bd_pins ps7_0_axi_periph/M03_ARESETN] \
  [get_bd_pins ps7_0_axi_periph/M04_ARESETN] [get_bd_pins ps7_0_axi_periph/M05_ARESETN] \
  [get_bd_pins ps7_0_axi_periph/M06_ARESETN] [get_bd_pins ps7_0_axi_periph/M07_ARESETN] \
  [get_bd_pins ps7_0_axi_periph/M08_ARESETN]
connect_bd_net [get_bd_pins s_axi_aclk] [get_bd_pins axis_clock_converter_0/s_axis_aclk]
connect_bd_net [get_bd_pins s_axi_aresetn] \
  [get_bd_pins fifo_1/s_axi_aresetn] [get_bd_pins axis_clock_converter_0/s_axis_aresetn] \
  [get_bd_pins axis_clock_converter_0/m_axis_aresetn]

current_bd_instance /control/uP_control
connect_bd_intf_net [get_bd_intf_pins S_AXI1] [get_bd_intf_pins finished/S_AXI]
connect_bd_intf_net [get_bd_intf_pins S_AXI2] [get_bd_intf_pins param_out_0_1/S_AXI]
connect_bd_intf_net [get_bd_intf_pins S_AXI3] [get_bd_intf_pins param_out_2_3/S_AXI]
connect_bd_intf_net [get_bd_intf_pins S_AXI4] [get_bd_intf_pins param_out_4_5/S_AXI]
connect_bd_intf_net [get_bd_intf_pins S_AXI5] [get_bd_intf_pins param_out_6_7/S_AXI]
connect_bd_intf_net [get_bd_intf_pins S_AXI6] [get_bd_intf_pins param_out_8_9/S_AXI]
connect_bd_intf_net [get_bd_intf_pins S_AXI7] [get_bd_intf_pins param_in_0_1/S_AXI]
connect_bd_intf_net [get_bd_intf_pins S_AXI] [get_bd_intf_pins enable_and_reset/S_AXI]
connect_bd_net [get_bd_pins enable/Dout] [get_bd_pins enable]
connect_bd_net [get_bd_pins enable_and_reset/gpio2_io_o] [get_bd_pins enable/Din]
connect_bd_net [get_bd_pins enable_and_reset/gpio_io_o] [get_bd_pins reset_n/Din]
connect_bd_net -net gpio2_io_i_0_1 [get_bd_pins gpio2_io_i_0] [get_bd_pins param_in_0_1/gpio2_io_i]
connect_bd_net -net gpio_io_i_0_1 [get_bd_pins finished] [get_bd_pins finished/gpio_io_i]
connect_bd_net -net gpio_io_i_0_2 [get_bd_pins gpio_io_i_0] [get_bd_pins param_in_0_1/gpio_io_i]
connect_bd_net [get_bd_pins param_out_0_1/gpio2_io_o] [get_bd_pins gpio2_io_o_0]
connect_bd_net [get_bd_pins param_out_0_1/gpio_io_o] [get_bd_pins gpio_io_o_0]
connect_bd_net [get_bd_pins param_out_2_3/gpio2_io_o] [get_bd_pins gpio2_io_o_1]
connect_bd_net [get_bd_pins param_out_2_3/gpio_io_o] [get_bd_pins gpio_io_o_1]
connect_bd_net [get_bd_pins param_out_4_5/gpio2_io_o] [get_bd_pins gpio2_io_o_2]
connect_bd_net [get_bd_pins param_out_4_5/gpio_io_o] [get_bd_pins gpio_io_o_2]
connect_bd_net [get_bd_pins param_out_6_7/gpio2_io_o] [get_bd_pins gpio2_io_o_3]
connect_bd_net [get_bd_pins param_out_6_7/gpio_io_o] [get_bd_pins gpio_io_o_3]
connect_bd_net [get_bd_pins param_out_8_9/gpio2_io_o] [get_bd_pins gpio2_io_o_4]
connect_bd_net [get_bd_pins param_out_8_9/gpio_io_o] [get_bd_pins gpio_io_o_4]
connect_bd_net -net processing_system7_0_FCLK_CLK0 [get_bd_pins s_axi_aclk] \
  [get_bd_pins finished/s_axi_aclk] [get_bd_pins enable_and_reset/s_axi_aclk] [get_bd_pins param_out_0_1/s_axi_aclk] \
  [get_bd_pins param_out_2_3/s_axi_aclk] [get_bd_pins param_out_4_5/s_axi_aclk] [get_bd_pins param_out_8_9/s_axi_aclk] \
  [get_bd_pins param_out_6_7/s_axi_aclk] [get_bd_pins param_in_0_1/s_axi_aclk]
connect_bd_net [get_bd_pins reset_n/Dout] [get_bd_pins reset_n]
connect_bd_net -net rst_ps7_0_125M_peripheral_aresetn [get_bd_pins s_axi_aresetn] \
  [get_bd_pins finished/s_axi_aresetn] [get_bd_pins enable_and_reset/s_axi_aresetn] [get_bd_pins param_out_0_1/s_axi_aresetn] \
  [get_bd_pins param_out_2_3/s_axi_aresetn] [get_bd_pins param_out_4_5/s_axi_aresetn] \
  [get_bd_pins param_out_6_7/s_axi_aresetn] [get_bd_pins param_in_0_1/s_axi_aresetn] \
  [get_bd_pins param_out_8_9/s_axi_aresetn]

current_bd_instance /procesamiento
connect_bd_net -net ADC_adc_clk [get_bd_pins clk_in] [get_bd_pins decimator/clk_in] [get_bd_pins fir_filter_wrapper_0/clk]
connect_bd_net -net axi_str_rxd_tdata_1 [get_bd_pins decimator/data_out] [get_bd_pins data_out]
connect_bd_net -net axi_str_rxd_tvalid1_1 [get_bd_pins decimator/data_out_valid] [get_bd_pins data_out_valid]
connect_bd_net -net control_param_out_0 [get_bd_pins sel_decimate_method] [get_bd_pins decimator/sel]
connect_bd_net [get_bd_pins decimate_value] [get_bd_pins decimator/decimate_value]
connect_bd_net [get_bd_pins decimator/finish] [get_bd_pins finish]
connect_bd_net [get_bd_pins fir_filter_wrapper_0/data_out] [get_bd_pins decimator/data_in]
connect_bd_net [get_bd_pins fir_filter_wrapper_0/data_out_valid] [get_bd_pins decimator/data_in_valid]
connect_bd_net -net selector_data_in_data_out [get_bd_pins data_in] [get_bd_pins fir_filter_wrapper_0/data_in]
connect_bd_net -net selector_data_in_data_out_valid [get_bd_pins data_in_valid] [get_bd_pins fir_filter_wrapper_0/data_in_valid]
connect_bd_net -net uP_control_Dout [get_bd_pins reset_n] [get_bd_pins decimator/reset_n] [get_bd_pins fir_filter_wrapper_0/reset_n]
connect_bd_net -net uP_control_Dout1 [get_bd_pins enable] [get_bd_pins decimator/enable] [get_bd_pins fir_filter_wrapper_0/enable]

current_bd_instance /procesamiento/decimator
connect_bd_net [get_bd_pins clk_in] [get_bd_pins decimator_0/clk] [get_bd_pins linear_mean_0/clk]
connect_bd_net [get_bd_pins decimator_0/data_out] [get_bd_pins selector_data_in1/data_in_0]
connect_bd_net [get_bd_pins decimator_0/data_out_valid] [get_bd_pins selector_data_in1/data_in_0_valid]
connect_bd_net [get_bd_pins decimator_0/finish] [get_bd_pins selector_data_in1/finish_0]
connect_bd_net [get_bd_pins linear_mean_0/data_out] [get_bd_pins selector_data_in1/data_in_1]
connect_bd_net [get_bd_pins linear_mean_0/data_out_valid] [get_bd_pins selector_data_in1/data_in_1_valid]
connect_bd_net [get_bd_pins linear_mean_0/finish] [get_bd_pins selector_data_in1/finish_1]
connect_bd_net [get_bd_pins sel] [get_bd_pins selector_data_in1/sel]
connect_bd_net [get_bd_pins selector_data_in1/data_out] [get_bd_pins data_out]
connect_bd_net [get_bd_pins selector_data_in1/data_out_valid] [get_bd_pins data_out_valid]
connect_bd_net [get_bd_pins selector_data_in1/finish] [get_bd_pins finish]
connect_bd_net -net selector_data_in_data_out [get_bd_pins data_in] [get_bd_pins decimator_0/data_in] [get_bd_pins linear_mean_0/data_in]
connect_bd_net -net selector_data_in_data_out_valid [get_bd_pins data_in_valid] \
  [get_bd_pins decimator_0/data_in_valid] [get_bd_pins linear_mean_0/data_in_valid]
connect_bd_net -net uP_control_Dout [get_bd_pins reset_n] [get_bd_pins decimator_0/reset_n] [get_bd_pins linear_mean_0/reset_n]
connect_bd_net -net uP_control_Dout1 [get_bd_pins enable] [get_bd_pins decimator_0/enable] [get_bd_pins linear_mean_0/enable]
connect_bd_net -net uP_control_gpio_io_o1 [get_bd_pins decimate_value] \
  [get_bd_pins decimator_0/decimate_value] [get_bd_pins linear_mean_0/decimate_value]

current_bd_instance /data_source
connect_bd_net -net ADC_M_AXIS_PORT1_tdata [get_bd_pins ADC/data_ch1] [get_bd_pins selector_data_in/data_in_1]
connect_bd_net -net ADC_M_AXIS_PORT1_tvalid [get_bd_pins ADC/data_ch1_valid] [get_bd_pins selector_data_in/data_in_1_valid]
connect_bd_net [get_bd_pins ADC/adc_clk] [get_bd_pins adc_clk] [get_bd_pins DAC/aclk] [get_bd_pins generador_sinusoidal/aclk]
connect_bd_net [get_bd_pins ADC/adc_csn_o] [get_bd_pins adc_csn_o]
connect_bd_net [get_bd_pins adc_clk_n_i] [get_bd_pins ADC/adc_clk_n_i]
connect_bd_net [get_bd_pins adc_clk_p_i] [get_bd_pins ADC/adc_clk_p_i]
connect_bd_net [get_bd_pins adc_dat_a_i] [get_bd_pins ADC/adc_dat_a_i]
connect_bd_net [get_bd_pins adc_dat_b_i] [get_bd_pins ADC/adc_dat_b_i]
connect_bd_net -net axis_red_pitaya_dac_0_dac_clk [get_bd_pins DAC/dac_clk_o] [get_bd_pins dac_clk_o]
connect_bd_net -net axis_red_pitaya_dac_0_dac_dat [get_bd_pins DAC/dac_dat_o] [get_bd_pins dac_dat_o]
connect_bd_net -net axis_red_pitaya_dac_0_dac_rst [get_bd_pins DAC/dac_rst_o] [get_bd_pins dac_rst_o]
connect_bd_net -net axis_red_pitaya_dac_0_dac_sel [get_bd_pins DAC/dac_sel_o] [get_bd_pins dac_sel_o]
connect_bd_net -net axis_red_pitaya_dac_0_dac_wrt [get_bd_pins DAC/dac_wrt_o] [get_bd_pins dac_wrt_o]
connect_bd_net -net cfg_data_1 [get_bd_pins phase_sen_interno] [get_bd_pins generador_sinusoidal/cfg_data]
connect_bd_net -net fase_dds_compiler_1 [get_bd_pins phase_dac] [get_bd_pins DAC/fase_dds_compiler]
connect_bd_net -net referencias_Dout1 [get_bd_pins generador_sinusoidal/signal_sen] [get_bd_pins selector_data_in/data_in_0]
connect_bd_net -net referencias_m_axis_data_tvalid [get_bd_pins generador_sinusoidal/signal_valid] [get_bd_pins selector_data_in/data_in_0_valid]
connect_bd_net -net sel_1 [get_bd_pins sel_data_source] [get_bd_pins selector_data_in/sel]
connect_bd_net [get_bd_pins selector_data_in/data_out] [get_bd_pins data_out]
connect_bd_net [get_bd_pins selector_data_in/data_out_valid] [get_bd_pins data_out_valid]
connect_bd_net -net uP_control_Dout [get_bd_pins aresetn] [get_bd_pins DAC/aresetn] [get_bd_pins generador_sinusoidal/aresetn]
connect_bd_net -net uP_control_Dout1 [get_bd_pins aclken] [get_bd_pins DAC/aclken] [get_bd_pins generador_sinusoidal/aclken]

current_bd_instance /data_source/generador_sinusoidal
connect_bd_net -net ADC_adc_clk [get_bd_pins aclk] [get_bd_pins dds_compiler_0/aclk] [get_bd_pins axis_constant_0/aclk]
connect_bd_net [get_bd_pins aclken] [get_bd_pins dds_compiler_0/aclken]
connect_bd_net [get_bd_pins aresetn] [get_bd_pins dds_compiler_0/aresetn]
connect_bd_net [get_bd_pins axis_constant_0/m_axis_tdata] [get_bd_pins dds_compiler_0/s_axis_phase_tdata]
connect_bd_net [get_bd_pins axis_constant_0/m_axis_tvalid] [get_bd_pins dds_compiler_0/s_axis_phase_tvalid]
connect_bd_net [get_bd_pins dds_compiler_0/m_axis_data_tdata] [get_bd_pins ref_sen/Din] [get_bd_pins ref_cos/Din]
connect_bd_net [get_bd_pins dds_compiler_0/m_axis_data_tvalid] [get_bd_pins signal_valid]
connect_bd_net [get_bd_pins ref_cos/Dout] [get_bd_pins signal_cos]
connect_bd_net -net uP_control_gpio2_io_o2 [get_bd_pins cfg_data] [get_bd_pins axis_constant_0/cfg_data]
connect_bd_net -net xlslice_1_Dout [get_bd_pins ref_sen/Dout] [get_bd_pins signal_sen]

current_bd_instance /data_source/DAC
connect_bd_intf_net [get_bd_intf_pins axis_constant_0/M_AXIS] [get_bd_intf_pins dds_compiler_0/S_AXIS_PHASE]
connect_bd_net [get_bd_pins fase_dds_compiler] [get_bd_pins axis_constant_0/cfg_data]
connect_bd_net [get_bd_pins aclken] [get_bd_pins dds_compiler_0/aclken]
connect_bd_net [get_bd_pins aresetn] [get_bd_pins dds_compiler_0/aresetn]
connect_bd_net -net axis_red_pitaya_adc_0_adc_clk [get_bd_pins aclk] \
  [get_bd_pins axis_constant_0/aclk] [get_bd_pins clk_wiz_0/clk_in1] [get_bd_pins dds_compiler_0/aclk] \
  [get_bd_pins axis_red_pitaya_dac_0/aclk]
connect_bd_net [get_bd_pins axis_red_pitaya_dac_0/dac_clk] [get_bd_pins dac_clk_o]
connect_bd_net [get_bd_pins axis_red_pitaya_dac_0/dac_dat] [get_bd_pins dac_dat_o]
connect_bd_net [get_bd_pins axis_red_pitaya_dac_0/dac_rst] [get_bd_pins dac_rst_o]
connect_bd_net [get_bd_pins axis_red_pitaya_dac_0/dac_sel] [get_bd_pins dac_sel_o]
connect_bd_net [get_bd_pins axis_red_pitaya_dac_0/dac_wrt] [get_bd_pins dac_wrt_o]
connect_bd_net [get_bd_pins clk_wiz_0/clk_out1] [get_bd_pins axis_red_pitaya_dac_0/ddr_clk]
connect_bd_net [get_bd_pins clk_wiz_0/locked] [get_bd_pins axis_red_pitaya_dac_0/locked]
connect_bd_net [get_bd_pins dds_compiler_0/m_axis_data_tdata] [get_bd_pins axis_red_pitaya_dac_0/s_axis_tdata]
connect_bd_net [get_bd_pins dds_compiler_0/m_axis_data_tvalid] [get_bd_pins axis_red_pitaya_dac_0/s_axis_tvalid]

current_bd_instance /data_source/ADC
connect_bd_intf_net [get_bd_intf_pins axis_red_pitaya_adc_0/M_AXIS] [get_bd_intf_pins signal_split_0/S_AXIS]
connect_bd_net [get_bd_pins adc_clk_n_i] [get_bd_pins axis_red_pitaya_adc_0/adc_clk_n]
connect_bd_net [get_bd_pins adc_clk_p_i] [get_bd_pins axis_red_pitaya_adc_0/adc_clk_p]
connect_bd_net [get_bd_pins adc_dat_a_i] [get_bd_pins axis_red_pitaya_adc_0/adc_dat_a]
connect_bd_net [get_bd_pins adc_dat_b_i] [get_bd_pins axis_red_pitaya_adc_0/adc_dat_b]
connect_bd_net [get_bd_pins axis_red_pitaya_adc_0/adc_clk] [get_bd_pins adc_clk]
connect_bd_net [get_bd_pins axis_red_pitaya_adc_0/adc_csn] [get_bd_pins adc_csn_o]
connect_bd_net [get_bd_pins signal_split_0/M_AXIS_PORT1_tdata] [get_bd_pins data_ch1]
connect_bd_net [get_bd_pins signal_split_0/M_AXIS_PORT1_tvalid] [get_bd_pins data_ch1_valid]
connect_bd_net [get_bd_pins signal_split_0/M_AXIS_PORT2_tdata] [get_bd_pins data_ch2]
connect_bd_net [get_bd_pins signal_split_0/M_AXIS_PORT2_tvalid] [get_bd_pins data_ch2_valid]

current_bd_instance /
connect_bd_intf_net -intf_net processing_system7_0_DDR [get_bd_intf_ports DDR] [get_bd_intf_pins control/DDR]
connect_bd_intf_net -intf_net processing_system7_0_FIXED_IO [get_bd_intf_ports FIXED_IO] [get_bd_intf_pins control/FIXED_IO]
connect_bd_net -net ADC_adc_clk [get_bd_pins data_source/adc_clk] [get_bd_pins control/data_to_fifo_clk] [get_bd_pins procesamiento/clk_in]
connect_bd_net -net ADC_adc_csn_o [get_bd_pins data_source/adc_csn_o] [get_bd_ports adc_csn_o]
connect_bd_net [get_bd_ports exp_p_tri_io] [get_bd_pins gpios_and_leds/exp_p_tri_io]
connect_bd_net [get_bd_ports exp_n_tri_io] [get_bd_pins gpios_and_leds/exp_n_tri_io]
connect_bd_net [get_bd_ports adc_clk_n_i] [get_bd_pins data_source/adc_clk_n_i]
connect_bd_net [get_bd_ports adc_clk_p_i] [get_bd_pins data_source/adc_clk_p_i]
connect_bd_net [get_bd_ports adc_dat_a_i] [get_bd_pins data_source/adc_dat_a_i]
connect_bd_net [get_bd_ports adc_dat_b_i] [get_bd_pins data_source/adc_dat_b_i]
connect_bd_net -net axi_str_rxd_tdata_1 [get_bd_pins procesamiento/data_out] [get_bd_pins control/data_to_fifo]
connect_bd_net -net axi_str_rxd_tvalid1_1 [get_bd_pins procesamiento/data_out_valid] [get_bd_pins control/data_to_fifo_valid]
connect_bd_net -net axis_red_pitaya_dac_0_dac_clk [get_bd_pins data_source/dac_clk_o] [get_bd_ports dac_clk_o]
connect_bd_net -net axis_red_pitaya_dac_0_dac_dat [get_bd_pins data_source/dac_dat_o] [get_bd_ports dac_dat_o]
connect_bd_net -net axis_red_pitaya_dac_0_dac_rst [get_bd_pins data_source/dac_rst_o] [get_bd_ports dac_rst_o]
connect_bd_net -net axis_red_pitaya_dac_0_dac_sel [get_bd_pins data_source/dac_sel_o] [get_bd_ports dac_sel_o]
connect_bd_net -net axis_red_pitaya_dac_0_dac_wrt [get_bd_pins data_source/dac_wrt_o] [get_bd_ports dac_wrt_o]
connect_bd_net [get_bd_pins control/param_out_0] [get_bd_pins procesamiento/sel_decimate_method]
connect_bd_net [get_bd_pins control/param_out_3] [get_bd_pins data_source/phase_sen_interno]
connect_bd_net [get_bd_pins control/param_out_4] [get_bd_pins data_source/phase_dac]
connect_bd_net [get_bd_ports daisy_n_i] [get_bd_pins util_ds_buf_1/IBUF_DS_N]
connect_bd_net [get_bd_ports daisy_p_i] [get_bd_pins util_ds_buf_1/IBUF_DS_P]
connect_bd_net -net decimate_value_1 [get_bd_pins control/param_out_1] [get_bd_pins procesamiento/decimate_value]
connect_bd_net -net drive_leds_0_signal_out [get_bd_pins gpios_and_leds/led_o] [get_bd_ports led_o]
connect_bd_net -net finished_1 [get_bd_pins procesamiento/finish] [get_bd_pins control/finished]
connect_bd_net -net sel_1 [get_bd_pins control/param_out_2] [get_bd_pins data_source/sel_data_source]
connect_bd_net -net selector_data_in_data_out [get_bd_pins data_source/data_out] [get_bd_pins procesamiento/data_in]
connect_bd_net -net selector_data_in_data_out_valid [get_bd_pins data_source/data_out_valid] [get_bd_pins procesamiento/data_in_valid]
connect_bd_net -net uP_control_Dout [get_bd_pins control/reset_n] [get_bd_pins procesamiento/reset_n] [get_bd_pins data_source/aresetn]
connect_bd_net -net uP_control_Dout1 [get_bd_pins control/enable] [get_bd_pins procesamiento/enable] [get_bd_pins data_source/aclken]
connect_bd_net [get_bd_pins util_ds_buf_1/IBUF_OUT] [get_bd_pins util_ds_buf_2/OBUF_IN]
connect_bd_net [get_bd_pins util_ds_buf_2/OBUF_DS_N] [get_bd_ports daisy_n_o]
connect_bd_net [get_bd_pins util_ds_buf_2/OBUF_DS_P] [get_bd_ports daisy_p_o]

# ---- address map ----
assign_bd_address -offset 0x41200000 -range 64K -target_address_space [get_bd_addr_spaces control/uP/processing_system7_0/Data] [get_bd_addr_segs control/uP_control/param_in_0_1/S_AXI/Reg]
assign_bd_address -offset 0x41210000 -range 64K -target_address_space [get_bd_addr_spaces control/uP/processing_system7_0/Data] [get_bd_addr_segs control/uP_control/finished/S_AXI/Reg]
assign_bd_address -offset 0x41220000 -range 64K -target_address_space [get_bd_addr_spaces control/uP/processing_system7_0/Data] [get_bd_addr_segs control/uP_control/param_out_0_1/S_AXI/Reg]
assign_bd_address -offset 0x41230000 -range 64K -target_address_space [get_bd_addr_spaces control/uP/processing_system7_0/Data] [get_bd_addr_segs control/uP_control/enable_and_reset/S_AXI/Reg]
assign_bd_address -offset 0x41240000 -range 64K -target_address_space [get_bd_addr_spaces control/uP/processing_system7_0/Data] [get_bd_addr_segs control/uP_control/param_out_2_3/S_AXI/Reg]
assign_bd_address -offset 0x41250000 -range 64K -target_address_space [get_bd_addr_spaces control/uP/processing_system7_0/Data] [get_bd_addr_segs control/uP_control/param_out_4_5/S_AXI/Reg]
assign_bd_address -offset 0x41260000 -range 64K -target_address_space [get_bd_addr_spaces control/uP/processing_system7_0/Data] [get_bd_addr_segs control/uP_control/param_out_6_7/S_AXI/Reg]
assign_bd_address -offset 0x41270000 -range 64K -target_address_space [get_bd_addr_spaces control/uP/processing_system7_0/Data] [get_bd_addr_segs control/uP_control/param_out_8_9/S_AXI/Reg]
assign_bd_address -offset 0x43C00000 -range 64K -target_address_space [get_bd_addr_spaces control/uP/processing_system7_0/Data] [get_bd_addr_segs control/uP/fifo_1/S_AXI/Mem0]

validate_bd_design
save_bd_design
